# EAGLE design tiny44 (EAGLE 9.6.1)
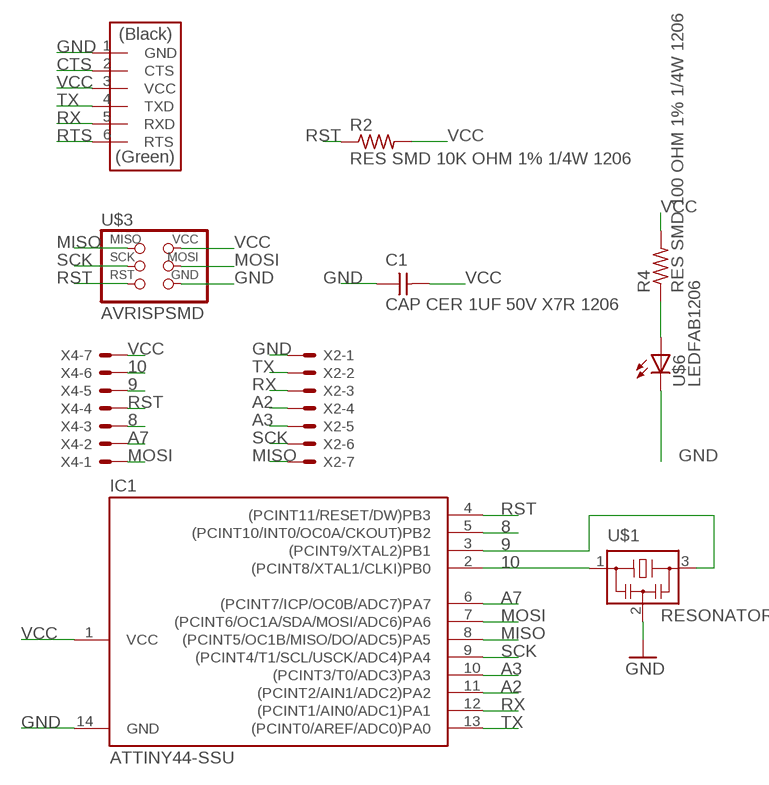
[diagram p0: schematic, sheet 1]

## Parts
C1  CAP CER 1UF 50V X7R 1206  CAP-UNPOLARIZEDFAB  [C1206FAB]
IC1  ATTINY44-SSU  [SOIC14]
R2  RES SMD 10K OHM 1% 1/4W 1206  RES-US1206FAB  [R1206FAB]
R4  RES SMD 100 OHM 1% 1/4W 1206  RES-US1206FAB  [R1206FAB]
U$1  RESONATOR  [EFOBM]
U$2  FTDI-SMD-HEADER  [1X06SMD]
U$3  AVRISPSMD  [2X03SMD]
U$6  LEDFAB1206  [LED1206FAB]
X2  KK-156-7  [KK-156-7]
X4  KK-156-7  [KK-156-7]

## Nets
8: IC1.5((PCINT10/INT0/OC0A/CKOUT)PB2) X4.3
9: IC1.3((PCINT9/XTAL2)PB1) U$1.3 X4.5
10: IC1.2((PCINT8/XTAL1/CLKI)PB0) U$1.1 X4.6
A2: IC1.11((PCINT2/AIN1/ADC2)PA2) X2.4
A3: IC1.10((PCINT3/T0/ADC3)PA3) X2.5
A7: IC1.6((PCINT7/ICP/OC0B/ADC7)PA7) X4.2
CTS: U$2.2(CTS)
GND: C1.1 IC1.14(GND) U$1.2 U$2.1(GND) U$3.6(GND) U$6.2(C) X2.1
MISO: IC1.8((PCINT5/OC1B/MISO/DO/ADC5)PA5) U$3.1(MISO) X2.7
MOSI: IC1.7((PCINT6/OC1A/SDA/MOSI/ADC6)PA6) U$3.4(MOSI) X4.1
PB2: R4.1 U$6.1(A)
RST: IC1.4((PCINT11/RESET/DW)PB3) R2.1 U$3.5(RST) X4.4
RTS: U$2.6(RTS)
RX: IC1.12((PCINT1/AIN0/ADC1)PA1) U$2.5(RXD) X2.3
SCK: IC1.9((PCINT4/T1/SCL/USCK/ADC4)PA4) U$3.3(SCK) X2.6
TX: IC1.13((PCINT0/AREF/ADC0)PA0) U$2.4(TXD) X2.2
VCC: C1.2 IC1.1(VCC) R2.2 R4.2 U$2.3(VCC) U$3.2(VCC) X4.7

## Library data of the parts
C1 = fab:CAP-UNPOLARIZED
IC1 = fab:ATTINY44
R2 R4 = fab:RES-US: Resistor (US Symbol) Variants with postfix FAB are widened to allow the routing of internal traces
U$1 = fab:RESONATOR; MF: Abracon Corporation; MPN: AWSCR-20.00MTD-T; OC_NEWARK: 13J2006
U$2 = fab:FTDI-SMD-HEADER
U$3 = fab:AVRISP
U$6 = fab:LED: LED
X2 X4 = con-molex:KK-156-7: KK 156 HEADER Source: http://www.molex.com/pdm_docs/sd/026604100_sd.pdf; MF: MOLEX; OC_FARNELL: unknown; OC_NEWARK: unknown

## Board
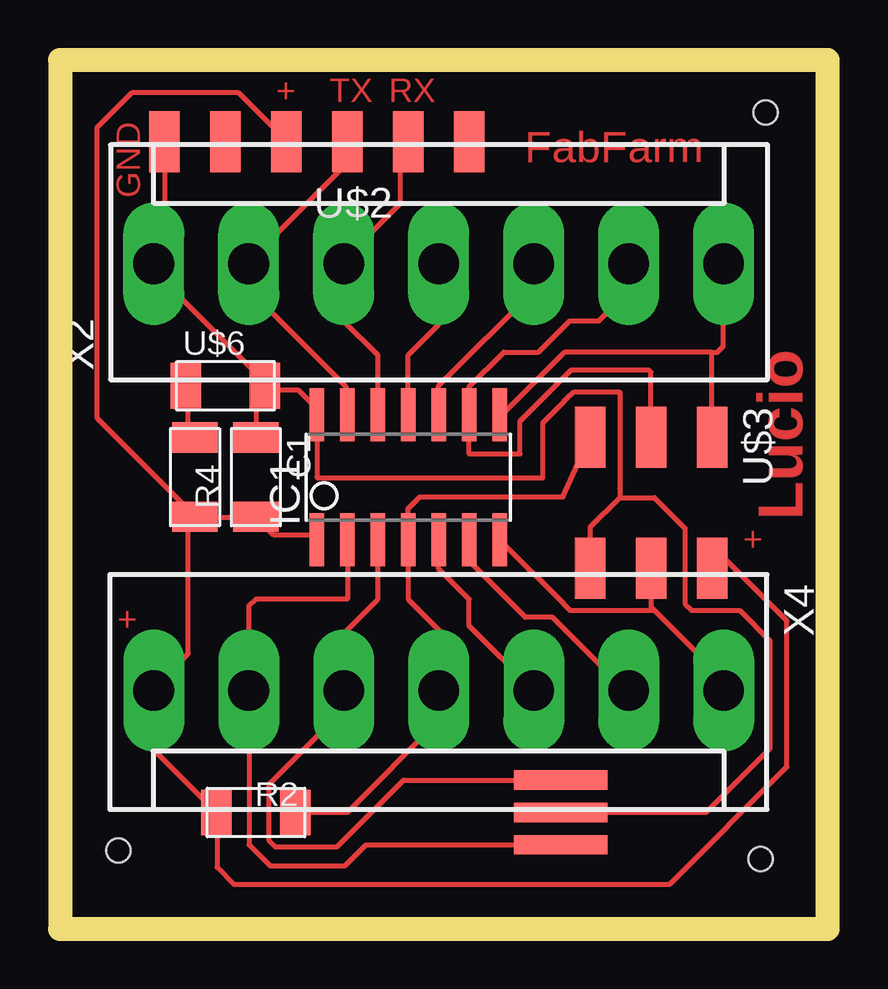
[diagram p1: board, top side]

Size 32 x 36.2 mm. Coordinates in mm from the lower left corner, seen from the top.
Outline: 0,0 32,0 32,36.2 0,36.2 0,0
Copper layers (1*16): Top 0.035mm / dielectric 1.5mm / Bottom 0.035mm
Design rules "default *": minimum track width 0.2mm, minimum drill 0.35mm, track to track 20mil, track to pad 15mil, pad to pad 20mil, via to via 20mil, smd to smd 20mil, copper to edge 10mil, drill to drill 6mil, minimum pad ring 10mil, minimum via ring 8mil, stop-mask expansion 4mil, vias tented up to drill 0mil, thermal gap 10mil
Holes 1 mm at 2.43,3.26 29.21,2.91 29.42,34.01
Milling: 4 lines

### Footprints (pad centres in the part's own frame; a part is rotated, then mirrored left to right if it is on the bottom)
C1206FAB = smd 1.27 x 1.905: 1 -1.651,0; 2 1.651,0
SOIC14 = smd 0.61 x 2.21: 1 -3.81,-2.603; 2 -2.54,-2.603; 3 -1.27,-2.603; 4 0,-2.603; 5 1.27,-2.603; 6 2.54,-2.603; 7 3.81,-2.603; 8 3.81,2.603; 9 2.54,2.603; 10 1.27,2.603; 11 0,2.603; 12 -1.27,2.603; 13 -2.54,2.603; 14 -3.81,2.603
R1206FAB = smd 1.27 x 1.905: 1 -1.651,0; 2 1.651,0
EFOBM = smd 0.8 x 3.9: 1 -1.35,0; 2 0,0; 3 1.35,0
1X06SMD = smd 2.54 x 1.27: 1 0,6.35; 2 0,3.81; 3 0,1.27; 4 0,-1.27; 5 0,-3.81; 6 0,-6.35
2X03SMD = smd 2.54 x 1.27: 1 -2.54,2.54; 2 2.92,2.54; 3 -2.54,0; 4 2.92,0; 5 -2.54,-2.54; 6 2.92,-2.54
LED1206FAB = smd 1.27 x 1.905: 1 -1.651,0; 2 1.651,0
KK-156-7 = drill 1.7 pad 2.184 long: 1 -11.88,0; 2 -7.92,0; 3 -3.96,0; 4 0,0; 5 3.96,0; 6 7.92,0; 7 11.88,0

### Placement (x,y rotation side)
C1  8.17,18.82 270 top
IC1  14.52,18.82 0 top
R2  8.17,4.85 180 top
R4  5.63,18.82 270 top
U$1  20.87,4.85 90 top
U$2  10.71,32.79 90 top
U$3  24.64,17.94 270 top
U$6  6.9,22.63 0 top
X2  15.79,27.71 0 top
X4  15.79,9.93 180 top

### Tracks (layer width: path | path; a pad name or v marks a point on that pad's centre or on a via)
8
  Top 0.2: X4.3 17.06,12.62 17.06,13.74 15.79,15.01 IC1.5
9
  Top 0.2: IC1.3 13.25,13.74 11.98,12.47 11.98,10.08 X4.5 11.83,9.13 8.71,6 8.71,3.7 8.99,3.42 11.55,3.42 14.33,6.2 U$1.3
10
  Top 0.2: IC1.2 11.98,13.74 8.17,13.74 7.87,13.44 X4.6 7.88,9.88 7.88,3.5 8.75,2.63 11.88,2.63 12.75,3.5 U$1.1
A2
  Top 0.2: IC1.11 14.52,23.9 15.79,25.17 X2.4
A3
  Top 0.2: IC1.10 15.79,22.63 19.75,26.59 X2.5
A7
  Top 0.2: IC1.6 17.13,16.13 17.13,15.25 19.4,12.98 20.54,12.98 23.02,10.5 X4.2
GND
  Top 0.2: U$2.1 4.36,29.4 3.89,28.93 3.89,27.73 X2.1 3.94,27.39 8.54,22.79 U$6.2 | C1.1 8.18,20.67 8.18,22.08 8.54,22.44 U$6.2 | U$6.2 8.89,22.44 9.95,22.44 10.66,21.73 IC1.14 10.71,18.82 10.76,18.78 20.12,18.78 20.12,21.07 20.98,21.93 20.98,21.95 21.26,22.23 21.28,22.23 21.4,22.35 23.35,22.35 23.33,18.37 23.33,17.97 | U$1.2 26.94,4.85 29.6,7.51 29.6,12.01 28.33,13.27 26.34,13.27 26.06,13.55 26.06,16.7 24.79,17.97 23.33,17.97 | U$3.6 22.1,16.73 23.33,17.97
MISO
  Top 0.2: IC1.8 18.44,21.42 21.04,24.02 27.18,24.02 | 27.18,24.02 27.41,24.02 27.65,24.27 27.65,27.39 X2.7 | U$3.1 27.18,24.02
MOSI
  Top 0.2: 24.78,13.27 27.65,10.4 X4.1 | 24.78,13.27 24.64,13.42 U$3.4 | IC1.7 20.98,13.57 20.98,13.55 21.26,13.27 24.78,13.27
PB2
  Top 0.2: U$6.1 5.35,22.44 5.35,20.67 R4.1
RST
  Top 0.2: R2.1 11.98,4.85 15.79,8.66 X4.4 15.79,12.47 14.52,13.74 IC1.4 14.5,16.5 14.5,17.5 15,18 20.98,18 U$3.5
RX
  Top 0.2: IC1.12 13.25,23.9 11.83,25.32 X2.3 11.72,27.75 14.2,30.23 14.2,32.7 U$2.5
SCK
  Top 0.2: U$3.3 24.64,23.19 24.54,23.29 21.32,23.29 19.18,21.15 19.18,19.79 17.06,19.79 IC1.9 17.06,22.58 18.5,24.03 19.95,24.03 21.26,25.33 22.48,25.33 23.71,26.57 X2.6
TX
  Top 0.2: IC1.13 11.93,21.47 11.93,22.58 7.87,26.64 X2.2 7.83,27.75 11.72,31.64 11.72,32.7 U$2.4
VCC
  Top 0.2: U$3.2 27.71,15.43 30.31,12.83 30.31,6.74 25.43,1.86 7.24,1.86 6.54,2.56 6.54,4.83 R2.2 3.91,7.46 X4.7 3.94,10.05 5.35,11.46 5.35,17.13 R4.2 | R4.2 5.71,17.13 7.83,17.13 C1.2 8.18,17.13 8.89,16.42 10.66,16.42 IC1.1 | R4.2 5.35,17.48 1.55,21.28 1.55,33.4 2.98,34.83 7.45,34.83 9.44,32.85 U$2.3

### Text on the board
Top: + | TX | RX | FabFarm | GND | Lucio | + | +